# Altium project lightSoakV1.PrjPcb (part 2 of 2)

## Sheet V1_input_channel_noNegSply_sch.SchDoc
size A3; SheetNumber: 2; SheetTotal: 5
Used 6 times, as channels U_V1_input_channel_noNegSply_sch, U_V1_input_channel_noNegSply_sch, U_V1_input_channel_noNegSply_sch, U_V1_input_channel_noNegSply_sch, U_V1_input_channel_noNegSply_sch, U_V1_input_channel_noNegSply_sch. Parts and nets are listed once, with the designators drawn on the sheet.
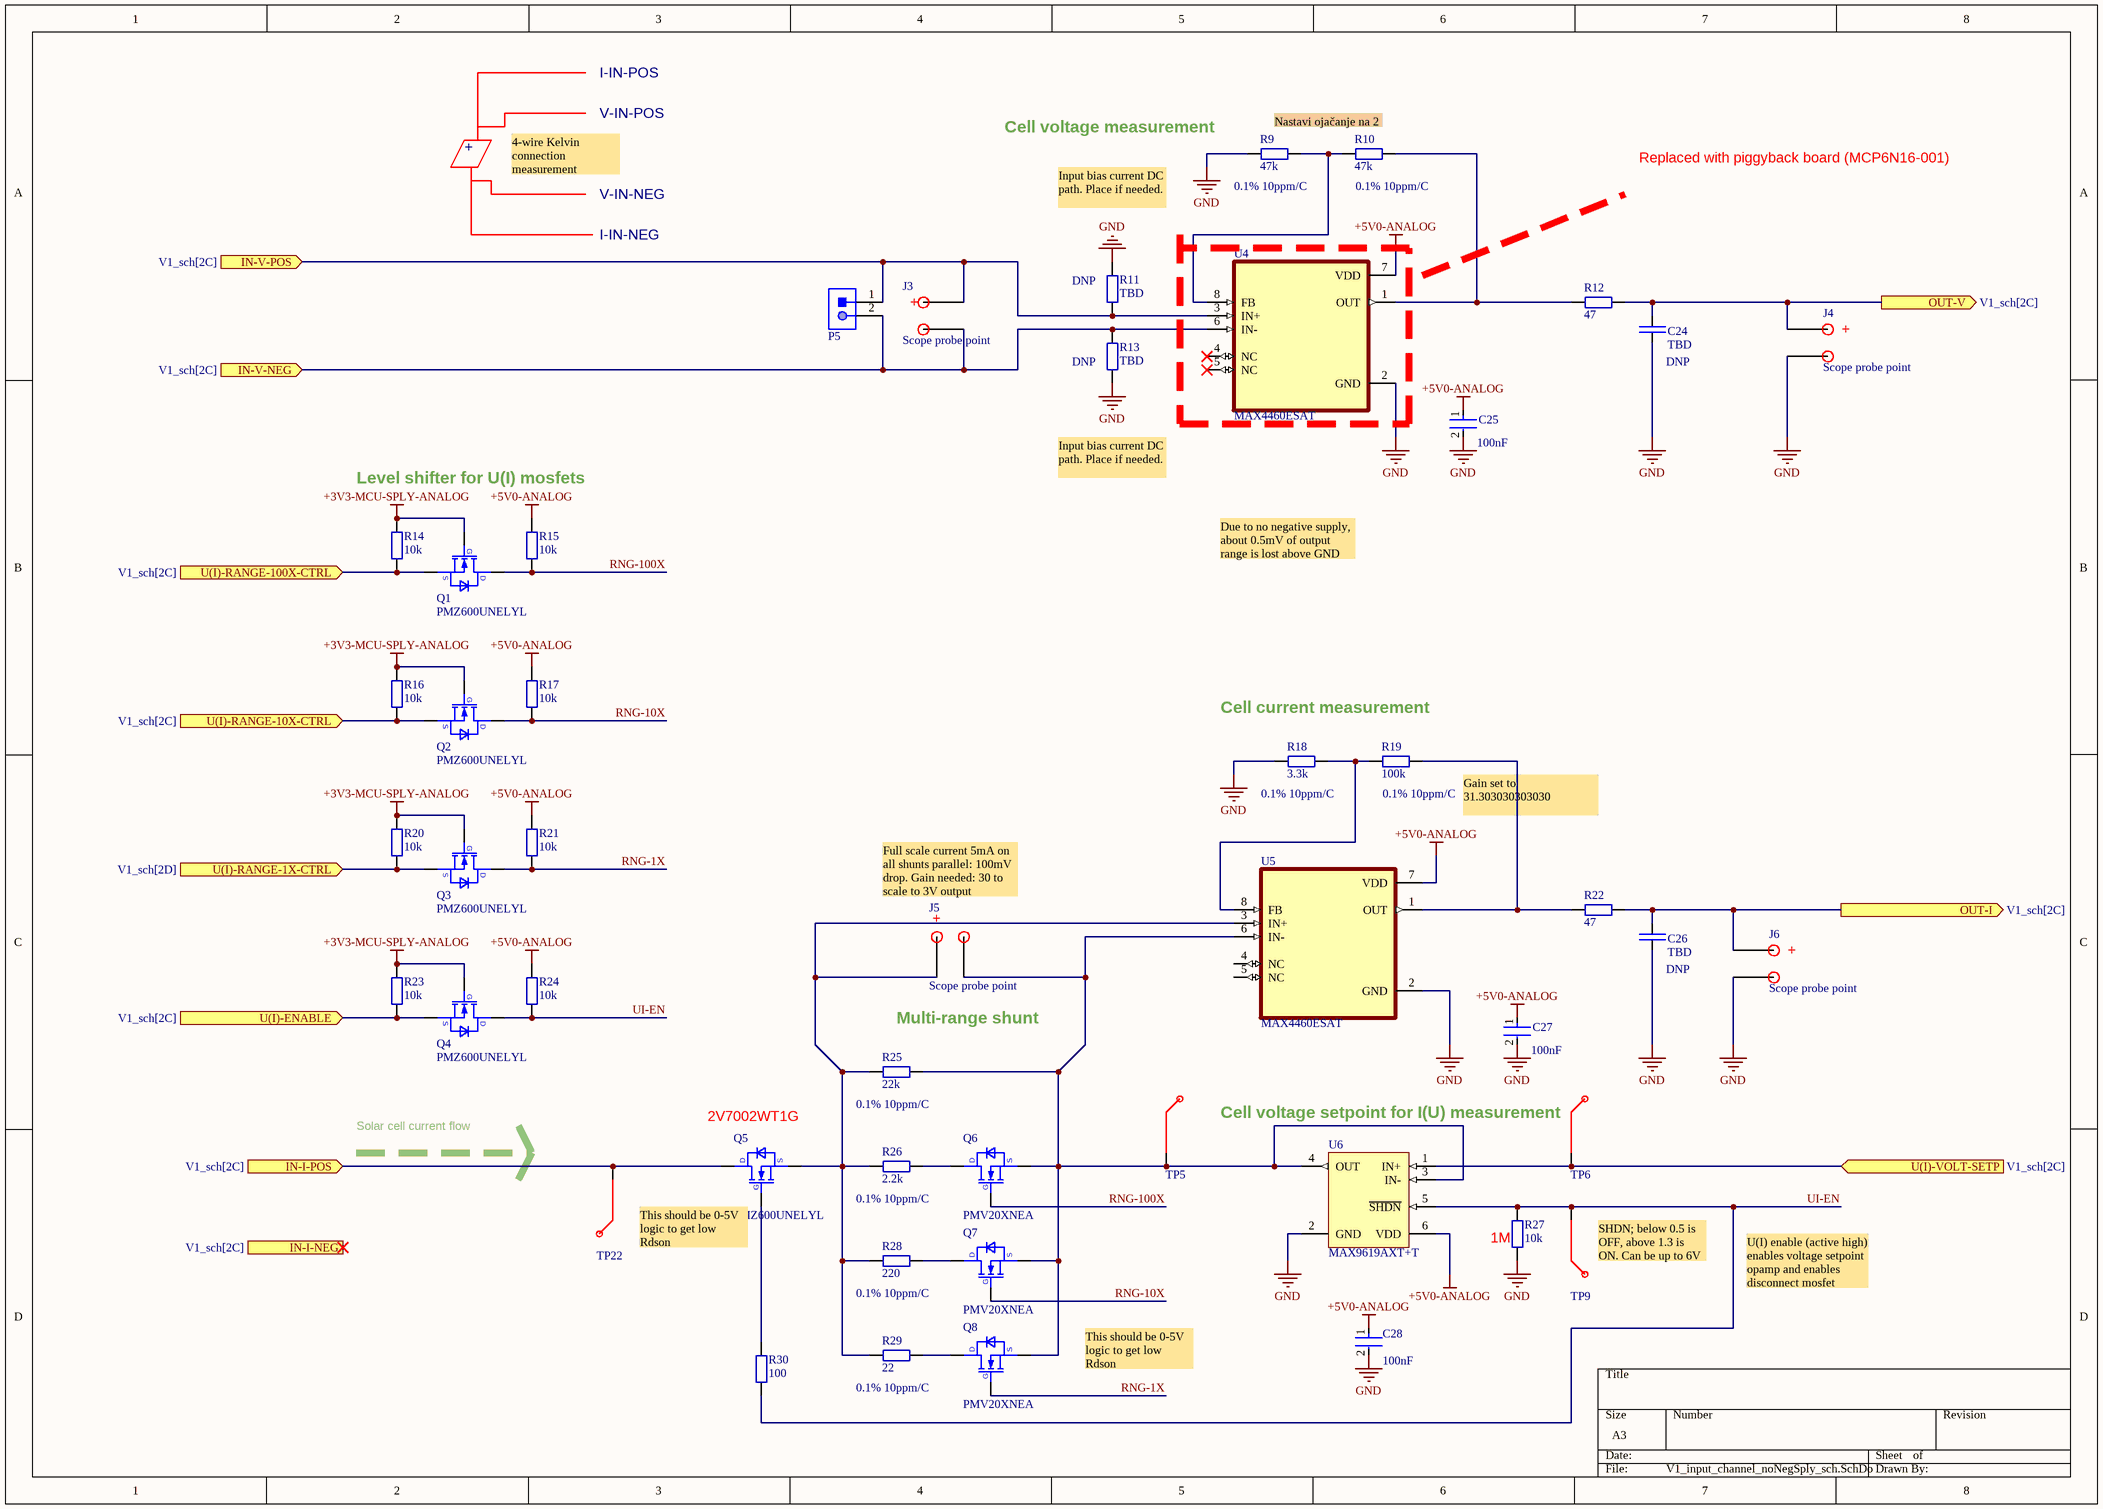
[diagram p6: V1_input_channel_noNegSply_sch.SchDoc]

### Parts
C24  value TBD  [FPR_0603_C_R0]  (hidden comment: PN_C0603_TBD)
C25  Capacitance: 100nF  [FP-885012206095-IPC_B]  (hidden comment: 885012206095)
C26  value TBD  [FPR_0603_C_R0]  (hidden comment: PN_C0603_TBD)
C27  Capacitance: 100nF  [FP-885012206095-IPC_B]  (hidden comment: 885012206095)
C28  Capacitance: 100nF  [FP-885012206095-IPC_B]  (hidden comment: 885012206095)
J3  Scope probe point  [scope with ground spring probe point]
J4  Scope probe point  [scope with ground spring probe point]
J5  Scope probe point  [scope with ground spring probe point]
J6  Scope probe point  [scope with ground spring probe point]
P5  61300211121  [61300211121]  (value not drawn)
Q1  PMZ600UNELYL  [DFN985X585X50-3N + SC-70 backup]
Q2  PMZ600UNELYL  [DFN985X585X50-3N + SC-70 backup]
Q3  PMZ600UNELYL  [DFN985X585X50-3N + SC-70 backup]
Q4  PMZ600UNELYL  [DFN985X585X50-3N + SC-70 backup]
Q5  PMZ600UNELYL  [DFN985X585X50-3N + SC-70 backup]
Q6  PMV20XNEA  [SOT-23 for nexperia mosfets]
Q7  PMV20XNEA  [SOT-23 for nexperia mosfets]
Q8  PMV20XNEA  [SOT-23 for nexperia mosfets]
R9  value 47k  Tolerance: 0.1% 10ppm/C  [FPR_0603_R_R0]  (hidden comment: PN_R0603_47k_0%1_10ppm)
R10  value 47k  Tolerance: 0.1% 10ppm/C  [FPR_0603_R_R0]  (hidden comment: PN_R0603_47k_0%1_10ppm)
R11  value TBD  [FPR_0805_R_R0]  (hidden comment: PN_R0603_TBD)
R12  value 47  [FPR_0603_R_R0]  (hidden comment: PN_R0603_TBD)
R13  value TBD  [FPR_0805_R_R0]  (hidden comment: PN_R0603_TBD)
R14  value 10k  [FPR_0603_R_R0]  (hidden comment: PN_R0603_10k)
R15  value 10k  [FPR_0603_R_R0]  (hidden comment: PN_R0603_10k)
R16  value 10k  [FPR_0603_R_R0]  (hidden comment: PN_R0603_10k)
R17  value 10k  [FPR_0603_R_R0]  (hidden comment: PN_R0603_10k)
R18  value 3.3k  Tolerance: 0.1% 10ppm/C  [FPR_0603_R_R0]  (hidden comment: PN_R0603_3k3_0%1_10ppm)
R19  value 100k  Tolerance: 0.1% 10ppm/C  [FPR_0603_R_R0]  (hidden comment: PN_R0603_100k_0%1_10ppm)
R20  value 10k  [FPR_0603_R_R0]  (hidden comment: PN_R0603_10k)
R21  value 10k  [FPR_0603_R_R0]  (hidden comment: PN_R0603_10k)
R22  value 47  [FPR_0603_R_R0]  (hidden comment: PN_R0603_TBD)
R23  value 10k  [FPR_0603_R_R0]  (hidden comment: PN_R0603_10k)
R24  value 10k  [FPR_0603_R_R0]  (hidden comment: PN_R0603_10k)
R25  value 22k  Tolerance: 0.1% 10ppm/C  [FPR_0603_R_R0]  (hidden comment: PN_R0603_22K_0%1_10ppm)
R26  value 2.2k  Tolerance: 0.1% 10ppm/C  [FPR_0603_R_R0]  (hidden comment: PN_R0603_2K2_0%1_10ppm)
R27  value 10k  [FPR_0603_R_R0]  (hidden comment: PN_R0603_10k)
R28  value 220  Tolerance: 0.1% 10ppm/C  [FPR_0603_R_R0]  (hidden comment: PN_R0603_220R_0%1_10ppm)
R29  value 22  Tolerance: 0.1% 10ppm/C  [FPR_0603_R_R0]  (hidden comment: PN_R0603_22R_0%1_10ppm)
R30  value 100  [FPR_0603_R_R0]  (hidden comment: PN_R0603_100R)
TP5  Test Point  [Test Point 1.5mm SMD]  (value not drawn)
TP6  Test Point  [Test Point 1.5mm SMD]  (value not drawn)
TP9  Test Point  [Test Point 1.5mm SMD]  (value not drawn)
TP22  Test Point  [Test Point 1.5mm SMD]  (value not drawn)
U4  MAX4460ESAT  [SOIC127P600X175-8N]
U5  MAX4460ESAT  [SOIC127P600X175-8N]
U6  MAX9619AXT+T  [X6SN+1_N]

### Ports
IN-I-NEG (in, see V1_sch[2C]), IN-I-POS (in, see V1_sch[2C]), IN-V-NEG (in, see V1_sch[2C]), IN-V-POS (in, see V1_sch[2C]), OUT-I (out, see V1_sch[2C]), OUT-V (out, see V1_sch[2C]), U(I)-ENABLE (in, see V1_sch[2C]), U(I)-RANGE-1X-CTRL (in, see V1_sch[2D]), U(I)-RANGE-10X-CTRL (in, see V1_sch[2C]), U(I)-RANGE-100X-CTRL (in, see V1_sch[2C]), U(I)-VOLT-SETP (in, see V1_sch[2C])

### Nets
+3V3-MCU-SPLY-ANALOG: Q1.1(GATE) Q2.1(GATE) Q3.1(GATE) Q4.1(GATE) R14.2 R16.2 R20.2 R23.2
+5V0-ANALOG: C25.1 C27.1 C28.1 R15.2 R17.2 R21.2 R24.2 U4.7(VDD) U5.7(VDD) U6.6(VDD)
GND: C24.1 C25.2 C26.1 C27.2 C28.2 J4.NEG J6.NEG R9.2 R11.2 R13.1 R18.2 R27.1 U4.2(GND) U5.2(GND) U6.2(GND)
IN-I-POS: Q5.3(DRAIN) TP22.1 ; port IN-I-POS
IN-V-NEG: J3.NEG P5.2 R13.2 U4.6(IN-) ; port IN-V-NEG
IN-V-POS: J3.POS P5.1 R11.1 U4.3(IN+) ; port IN-V-POS
OUT-I: C26.2 J6.POS R22.1 ; port OUT-I
OUT-V: C24.2 J4.POS R12.1 ; port OUT-V
RNG-1X: Q3.3(DRAIN) Q8.1(GATE) R21.1
RNG-10X: Q2.3(DRAIN) Q7.1(GATE) R17.1
RNG-100X: Q1.3(DRAIN) Q6.1(GATE) R15.1
U(I)-ENABLE: Q4.2(SOURCE) R23.1 ; port U(I)-ENABLE
U(I)-RANGE-1X-CTRL: Q3.2(SOURCE) R20.1 ; port U(I)-RANGE-1X-CTRL
U(I)-RANGE-10X-CTRL: Q2.2(SOURCE) R16.1 ; port U(I)-RANGE-10X-CTRL
U(I)-RANGE-100X-CTRL: Q1.2(SOURCE) R14.1 ; port U(I)-RANGE-100X-CTRL
U(I)-VOLT-SETP: TP6.1 U6.1(IN+) ; port U(I)-VOLT-SETP
UI-EN: Q4.3(DRAIN) R24.1 R27.2 R30.1 TP9.1 U6.5(~{SHDN})
NetJ5_NEG: J5.NEG Q6.2(SOURCE) Q7.2(SOURCE) Q8.2(SOURCE) R25.1 TP5.1 U5.6(IN-) U6.3(IN-) U6.4(OUT)
NetJ5_POS: J5.POS Q5.2(SOURCE) R25.2 R26.2 R28.2 R29.2 U5.3(IN+)
NetQ5_1: Q5.1(GATE) R30.2
NetQ6_3: Q6.3(DRAIN) R26.1
NetQ7_3: Q7.3(DRAIN) R28.1
NetQ8_3: Q8.3(DRAIN) R29.1
NetR9_1: R9.1 R10.2 U4.8(FB)
NetR10_1: R10.1 R12.2 U4.1(OUT)
NetR18_1: R18.1 R19.2 U5.8(FB)
NetR19_1: R19.1 R22.2 U5.1(OUT)

Not connected (* = marked no-connect by the designer): U4 4(NC)* 5(NC)*; U5 4(NC) 5(NC)

### Channels
U_V1_input_channel_noNegSply_sch: designators end in _U_V1_input_channel_noNegSply_sch#1; ports IN-I-NEG=DUT-BB12 IN-I-POS=DUT-A2 IN-V-NEG=DUT-BB11 IN-V-POS=DUT-A1 OUT-I=CH1-CUR OUT-V=CH1-VOLT U(I)-ENABLE=CH1-CUR-EN U(I)-RANGE-1X-CTRL=CH1-SHNTRNG-1 U(I)-RANGE-10X-CTRL=CH1-SHNTRNG-10 U(I)-RANGE-100X-CTRL=CH1-SHNTRNG-100 U(I)-VOLT-SETP=CH1-SETPOINT
U_V1_input_channel_noNegSply_sch: designators end in _U_V1_input_channel_noNegSply_sch#2; ports IN-I-NEG=DUT-BB12 IN-I-POS=DUT-B2 IN-V-NEG=DUT-BB21 IN-V-POS=DUT-B1 OUT-I=CH2-CUR OUT-V=CH2-VOLT U(I)-ENABLE=CH2-CUR-EN U(I)-RANGE-1X-CTRL=CH2-SHNTRNG-1 U(I)-RANGE-10X-CTRL=CH2-SHNTRNG-10 U(I)-RANGE-100X-CTRL=CH2-SHNTRNG-100 U(I)-VOLT-SETP=CH2-SETPOINT
U_V1_input_channel_noNegSply_sch: designators end in _U_V1_input_channel_noNegSply_sch#3; ports IN-I-NEG=DUT-BB12 IN-I-POS=DUT-C2 IN-V-NEG=DUT-BB11 IN-V-POS=DUT-C1 OUT-I=CH3-CUR OUT-V=CH3-VOLT U(I)-ENABLE=CH3-CUR-EN U(I)-RANGE-1X-CTRL=CH3-SHNTRNG-1 U(I)-RANGE-10X-CTRL=CH3-SHNTRNG-10 U(I)-RANGE-100X-CTRL=CH3-SHNTRNG-100 U(I)-VOLT-SETP=CH3-SETPOINT
U_V1_input_channel_noNegSply_sch: designators end in _U_V1_input_channel_noNegSply_sch#4; ports IN-I-NEG=DUT-BB12 IN-I-POS=DUT-D2 IN-V-NEG=DUT-BB21 IN-V-POS=DUT-D1 OUT-I=CH4-CUR OUT-V=CH4-VOLT U(I)-ENABLE=CH4-CUR-EN U(I)-RANGE-1X-CTRL=CH4-SHNTRNG-1 U(I)-RANGE-10X-CTRL=CH4-SHNTRNG-10 U(I)-RANGE-100X-CTRL=CH4-SHNTRNG-100 U(I)-VOLT-SETP=CH4-SETPOINT
U_V1_input_channel_noNegSply_sch: designators end in _U_V1_input_channel_noNegSply_sch#5; ports IN-I-NEG=DUT-BB12 IN-I-POS=DUT-E2 IN-V-NEG=DUT-BB11 IN-V-POS=DUT-E1 OUT-I=CH5-CUR OUT-V=CH5-VOLT U(I)-ENABLE=CH5-CUR-EN U(I)-RANGE-1X-CTRL=CH5-SHNTRNG-1 U(I)-RANGE-10X-CTRL=CH5-SHNTRNG-10 U(I)-RANGE-100X-CTRL=CH5-SHNTRNG-100 U(I)-VOLT-SETP=CH5-SETPOINT
U_V1_input_channel_noNegSply_sch: designators end in _U_V1_input_channel_noNegSply_sch#6; ports IN-I-NEG=DUT-BB12 IN-I-POS=DUT-F2 IN-V-NEG=DUT-BB21 IN-V-POS=DUT-F1 OUT-I=CH6-CUR OUT-V=CH6-VOLT U(I)-ENABLE=CH6-CUR-EN U(I)-RANGE-1X-CTRL=CH6-SHNTRNG-1 U(I)-RANGE-10X-CTRL=CH6-SHNTRNG-10 U(I)-RANGE-100X-CTRL=CH6-SHNTRNG-100 U(I)-VOLT-SETP=CH6-SETPOINT

### Notes on the sheet
- I-IN-POS
- V-IN-POS
- +
- 4-wire Kelvin connection measurement
- Cell voltage measurement
- Nastavi ojačanje na 2
- Replaced with piggyback board (MCP6N16-001)
- I-IN-NEG
- V-IN-NEG
- Input bias current DC path. Place if needed.
- Level shifter for U(I) mosfets
- Due to no negative supply, about 0.5mV of output range is lost above GND
- Cell current measurement
- Gain set to 31.303030303030
- (near J5) Full scale current 5mA on all shunts parallel: 100mV drop. Gain needed: 30 to scale to 3V output
- (near R25) Multi-range shunt
- Solar cell current flow
- (near Q5) 2V7002WT1G
- (near TP6) Cell voltage setpoint for I(U) measurement
- (near Q5) This should be 0-5V logic to get low Rdson
- (near R27) 1M
- (near TP9) SHDN; below 0.5 is OFF, above 1.3 is ON. Can be up to 6V
- U(I) enable (active high) enables voltage setpoint opamp and enables disconnect mosfet
- This should be 0-5V logic to get low Rdson
- (in symbol PMV20XNEA) D; S; G
- (in symbol PMZ600UNELYL) D; S; G
- (in symbol Scope probe point) +

### Library data of the parts
C24 C26 = C: Capacitor - generic SMD; DNP: DNP
C25 C27 C28 = CMP-207839-000004-1: CAP CER 0.1UF 50V X7R 0603; Tolerance: 10%; RoHS Compliant: Yes; Thickness: 0.037inch; Voltage Rating: 50V; Packaging: Cut Tape; Dielectric: X7R; Series: WCAP-CSGP; Width: 0.031inch; Max Operating Temperature: 125°C; Min Operating Temperature: -55°C; Case/Package: 0603; Case Code (Metric): 1608; Case Code (Imperial): 0603; Length: 0.063inch; Mount: Surface Mount; Voltage Rating (DC): 50V
P5 = CMP-1712-00002-4: THT Vertical Pin Header WR-PHD, Pitch 2.54 mm, Single Row, 2 pins; Manufacturer: Wurth Elektronik; Rated Current: 3A; Gender: Male; Withstanding Voltage: 500VAC; Working Voltage: 250VAC; Pitch: 2.54mm; Contact Resistance: 20mOhm; Pin Number: 2; Mounting Technology: THT; Orientation: Vertical; Operating Temperature: -40to105degC; Packaging: Bag; Publisher: WurthElektronik; Datasheet URL: https://katalog.we-online.de/em/datasheet/6130xx11121.pdf; Manufacturer URL: http://www.we-online.de; Row Number: Single; Package Reference: 61300211121; Part Number: 61300211121
Q1-Q5 = PMZ600UNELYL: Low leakage N mosfet
Q6-Q8 = PMV20XNEA: sot-23 N mosfet low Rdson
R9-R30 = R: Resistor - generic SMD
  R11 R13: DNP: DNP
U6 = CMP-0252-00044-1: 1.5MHz, High-Efficiency Single Op Amp with Zero-Drift and Rail to Rail IO, 6-Pin SC70, -40°C to +125°C, Pb-Free, Tape and Reel; ComponentLink2Description: Datasheet; ComponentLink3URL: http://pdfserv.maxim-ic.com/package_dwgs/21-0077.PDF; Code_JEDEC: MO-203; ComponentLink1URL: http://www.maxim-ic.com; ComponentLink3Description: Package Specification; ComponentLink2URL: http://datasheets.maxim-ic.com/en/ds/MAX9617-MAX9620.pdf; PackageVersion: revH, 2010; ComponentLink1Description: Manufacturer URL; PackageReference: X6SN+1; PackageDescription: 6-Pin SL70 Package 2 x 1.3 mm Body ,0.65 mm Pitch, Pb-Free; DatasheetVersion: Rev 5, Jul-2011
U4 U5 = MAX4460ESAT: Package: None; Price: None; Value: *; MP: MAX4460ESAT; Availability: Unavailable

## Sheet V1_PWM-to-analog_sch.SchDoc
size A4; SheetNumber: 5; SheetTotal: 5
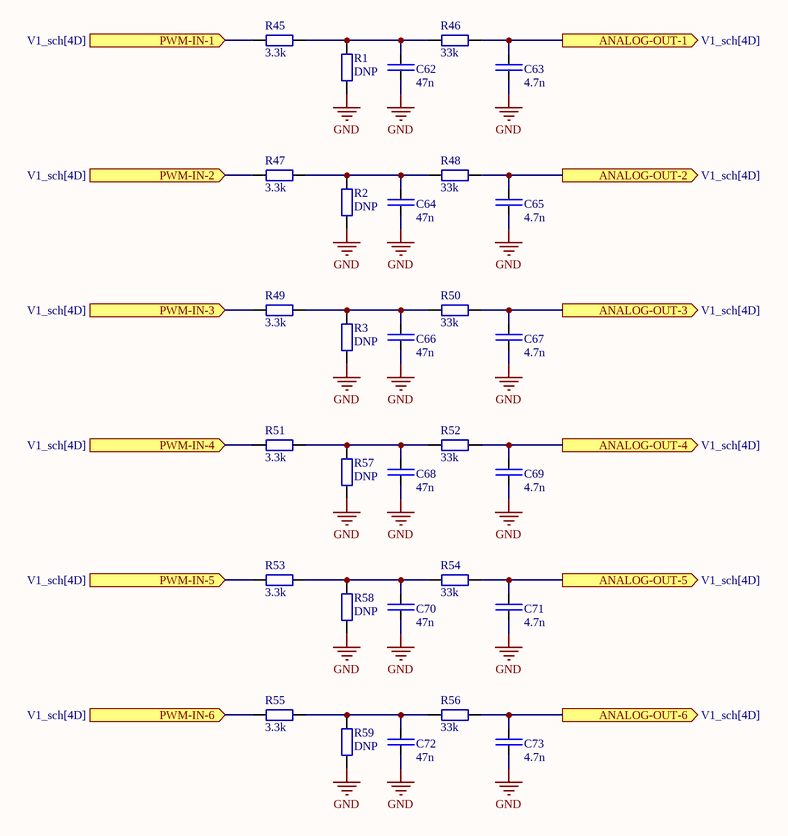
[diagram p7: V1_PWM-to-analog_sch.SchDoc]

### Parts
C62  value 47n  [FPR_0603_C_R0]  (hidden comment: PN_C0603_TBD)
C63  value 4.7n  [FPR_0603_C_R0]  (hidden comment: PN_C0603_TBD)
C64  value 47n  [FPR_0603_C_R0]  (hidden comment: PN_C0603_TBD)
C65  value 4.7n  [FPR_0603_C_R0]  (hidden comment: PN_C0603_TBD)
C66  value 47n  [FPR_0603_C_R0]  (hidden comment: PN_C0603_TBD)
C67  value 4.7n  [FPR_0603_C_R0]  (hidden comment: PN_C0603_TBD)
C68  value 47n  [FPR_0603_C_R0]  (hidden comment: PN_C0603_TBD)
C69  value 4.7n  [FPR_0603_C_R0]  (hidden comment: PN_C0603_TBD)
C70  value 47n  [FPR_0603_C_R0]  (hidden comment: PN_C0603_TBD)
C71  value 4.7n  [FPR_0603_C_R0]  (hidden comment: PN_C0603_TBD)
C72  value 47n  [FPR_0603_C_R0]  (hidden comment: PN_C0603_TBD)
C73  value 4.7n  [FPR_0603_C_R0]  (hidden comment: PN_C0603_TBD)
R1  value DNP  [FPR_0603_R_R0]  (hidden comment: PN_R0603_TBD)
R2  value DNP  [FPR_0603_R_R0]  (hidden comment: PN_R0603_TBD)
R3  value DNP  [FPR_0603_R_R0]  (hidden comment: PN_R0603_TBD)
R45  value 3.3k  [FPR_0603_R_R0]  (hidden comment: PN_R0603_TBD)
R46  value 33k  [FPR_0603_R_R0]  (hidden comment: PN_R0603_TBD)
R47  value 3.3k  [FPR_0603_R_R0]  (hidden comment: PN_R0603_TBD)
R48  value 33k  [FPR_0603_R_R0]  (hidden comment: PN_R0603_TBD)
R49  value 3.3k  [FPR_0603_R_R0]  (hidden comment: PN_R0603_TBD)
R50  value 33k  [FPR_0603_R_R0]  (hidden comment: PN_R0603_TBD)
R51  value 3.3k  [FPR_0603_R_R0]  (hidden comment: PN_R0603_TBD)
R52  value 33k  [FPR_0603_R_R0]  (hidden comment: PN_R0603_TBD)
R53  value 3.3k  [FPR_0603_R_R0]  (hidden comment: PN_R0603_TBD)
R54  value 33k  [FPR_0603_R_R0]  (hidden comment: PN_R0603_TBD)
R55  value 3.3k  [FPR_0603_R_R0]  (hidden comment: PN_R0603_TBD)
R56  value 33k  [FPR_0603_R_R0]  (hidden comment: PN_R0603_TBD)
R57  value DNP  [FPR_0603_R_R0]  (hidden comment: PN_R0603_TBD)
R58  value DNP  [FPR_0603_R_R0]  (hidden comment: PN_R0603_TBD)
R59  value DNP  [FPR_0603_R_R0]  (hidden comment: PN_R0603_TBD)

### Ports
ANALOG-OUT-1 (out, see V1_sch[4D]), ANALOG-OUT-2 (out, see V1_sch[4D]), ANALOG-OUT-3 (out, see V1_sch[4D]), ANALOG-OUT-4 (out, see V1_sch[4D]), ANALOG-OUT-5 (out, see V1_sch[4D]), ANALOG-OUT-6 (out, see V1_sch[4D]), PWM-IN-1 (in, see V1_sch[4D]), PWM-IN-2 (in, see V1_sch[4D]), PWM-IN-3 (in, see V1_sch[4D]), PWM-IN-4 (in, see V1_sch[4D]), PWM-IN-5 (in, see V1_sch[4D]), PWM-IN-6 (in, see V1_sch[4D])

### Nets
GND: C62.1 C63.1 C64.1 C65.1 C66.1 C67.1 C68.1 C69.1 C70.1 C71.1 C72.1 C73.1 R1.2 R2.2 R3.2 R57.2 R58.2 R59.2
CH1-SETPOINT: C63.2 R46.1 ; port ANALOG-OUT-1
CH2-SETPOINT: C65.2 R48.1 ; port ANALOG-OUT-2
CH3-SETPOINT: C67.2 R50.1 ; port ANALOG-OUT-3
CH4-SETPOINT: C69.2 R52.1 ; port ANALOG-OUT-4
CH5-SETPOINT: C71.2 R54.1 ; port ANALOG-OUT-5
CH6-SETPOINT: C73.2 R56.1 ; port ANALOG-OUT-6
PWM-SETP-1: R45.2 ; port PWM-IN-1
PWM-SETP-2: R47.2 ; port PWM-IN-2
PWM-SETP-3: R49.2 ; port PWM-IN-3
PWM-SETP-4: R51.2 ; port PWM-IN-4
PWM-SETP-5: R53.2 ; port PWM-IN-5
PWM-SETP-6: R55.2 ; port PWM-IN-6
NetC62_2: C62.2 R1.1 R45.1 R46.2
NetC64_2: C64.2 R2.1 R47.1 R48.2
NetC66_2: C66.2 R3.1 R49.1 R50.2
NetC68_2: C68.2 R51.1 R52.2 R57.1
NetC70_2: C70.2 R53.1 R54.2 R58.1
NetC72_2: C72.2 R55.1 R56.2 R59.1

### Library data of the parts
C62-C73 = C: Capacitor - generic SMD
R1-R3 R45-R59 = R: Resistor - generic SMD

## Nets that join several sheets
+3V3-MCU-SPLY: V1_sch (24 pins), V1_pwr_sply_noNegSply_sch (5 pins)
+3V3-MCU-SPLY-ANALOG: V1_sch (C17.2 FB1.2 U2.45), U_V1_input_channel_noNegSply_sch (8 pins), U_V1_input_channel_noNegSply_sch (8 pins), U_V1_input_channel_noNegSply_sch (8 pins), U_V1_input_channel_noNegSply_sch (8 pins), U_V1_input_channel_noNegSply_sch (8 pins), U_V1_input_channel_noNegSply_sch (8 pins)
+5V0-ANALOG: V1_sch (C13.1 U3.3 U3.4), V1_pwr_sply_noNegSply_sch (8 pins), U_V1_input_channel_noNegSply_sch (10 pins), U_V1_input_channel_noNegSply_sch (10 pins), U_V1_input_channel_noNegSply_sch (10 pins), U_V1_input_channel_noNegSply_sch (10 pins), U_V1_input_channel_noNegSply_sch (10 pins), U_V1_input_channel_noNegSply_sch (10 pins)
+12V-NOFILTER: V1_sch (J2.5 P4.1), V1_pwr_sply_noNegSply_sch (9 pins)
+24V0: V1_sch (M1.1), V1_pwr_sply_noNegSply_sch (7 pins)
+VBUS: V1_pwr_sply_noNegSply_sch (D3.2), V1_USB_sch (7 pins)
+VIN-NOFILTER: V1_sch (J2.1 J2.2), V1_pwr_sply_noNegSply_sch (5 pins)
DUT-BB12: V1_sch (J1.12 J1.14), V1_pwr_sply_noNegSply_sch (TP17.1 U11.1 U11.4)
GND: V1_sch (57 pins), V1_pwr_sply_noNegSply_sch (41 pins), V1_USB_sch (15 pins), U_V1_input_channel_noNegSply_sch (15 pins), U_V1_input_channel_noNegSply_sch (15 pins), U_V1_input_channel_noNegSply_sch (15 pins), U_V1_input_channel_noNegSply_sch (15 pins), U_V1_input_channel_noNegSply_sch (15 pins), U_V1_input_channel_noNegSply_sch (15 pins), V1_PWM-to-analog_sch (18 pins)
PWRGND: V1_sch (J2.3 J2.4), V1_pwr_sply_noNegSply_sch (5 pins)
CH1-CUR: V1_sch (C18.1 U2.53), U_V1_input_channel_noNegSply_sch (C26_U_V1_input_channel_noNegSply_sch#1.2 J6_U_V1_input_channel_noNegSply_sch#1.POS R22_U_V1_input_channel_noNegSply_sch#1.1)
CH1-CUR-EN: V1_sch (U2.18), U_V1_input_channel_noNegSply_sch (Q4_U_V1_input_channel_noNegSply_sch#1.2 R23_U_V1_input_channel_noNegSply_sch#1.1)
CH1-SETPOINT: U_V1_input_channel_noNegSply_sch (TP6_U_V1_input_channel_noNegSply_sch#1.1 U6_U_V1_input_channel_noNegSply_sch#1.1), V1_PWM-to-analog_sch (C63.2 R46.1)
CH1-SHNTRNG-1: V1_sch (U2.10), U_V1_input_channel_noNegSply_sch (Q3_U_V1_input_channel_noNegSply_sch#1.2 R20_U_V1_input_channel_noNegSply_sch#1.1)
CH1-SHNTRNG-10: V1_sch (U2.4), U_V1_input_channel_noNegSply_sch (Q2_U_V1_input_channel_noNegSply_sch#1.2 R16_U_V1_input_channel_noNegSply_sch#1.1)
CH1-SHNTRNG-100: V1_sch (U2.3), U_V1_input_channel_noNegSply_sch (Q1_U_V1_input_channel_noNegSply_sch#1.2 R14_U_V1_input_channel_noNegSply_sch#1.1)
CH1-VOLT: V1_sch (C19.1 U2.22), U_V1_input_channel_noNegSply_sch (C24_U_V1_input_channel_noNegSply_sch#1.2 J4_U_V1_input_channel_noNegSply_sch#1.POS R12_U_V1_input_channel_noNegSply_sch#1.1)
CH2-CUR: V1_sch (C23.1 U2.56), U_V1_input_channel_noNegSply_sch (C26_U_V1_input_channel_noNegSply_sch#2.2 J6_U_V1_input_channel_noNegSply_sch#2.POS R22_U_V1_input_channel_noNegSply_sch#2.1)
CH2-CUR-EN: V1_sch (U2.2), U_V1_input_channel_noNegSply_sch (Q4_U_V1_input_channel_noNegSply_sch#2.2 R23_U_V1_input_channel_noNegSply_sch#2.1)
CH2-SETPOINT: U_V1_input_channel_noNegSply_sch (TP6_U_V1_input_channel_noNegSply_sch#2.1 U6_U_V1_input_channel_noNegSply_sch#2.1), V1_PWM-to-analog_sch (C65.2 R48.1)
CH2-SHNTRNG-1: V1_sch (U2.117), U_V1_input_channel_noNegSply_sch (Q3_U_V1_input_channel_noNegSply_sch#2.2 R20_U_V1_input_channel_noNegSply_sch#2.1)
CH2-SHNTRNG-10: V1_sch (U2.114), U_V1_input_channel_noNegSply_sch (Q2_U_V1_input_channel_noNegSply_sch#2.2 R16_U_V1_input_channel_noNegSply_sch#2.1)
CH2-SHNTRNG-100: V1_sch (U2.112), U_V1_input_channel_noNegSply_sch (Q1_U_V1_input_channel_noNegSply_sch#2.2 R14_U_V1_input_channel_noNegSply_sch#2.1)
CH2-VOLT: V1_sch (C44.1 U2.25), U_V1_input_channel_noNegSply_sch (C24_U_V1_input_channel_noNegSply_sch#2.2 J4_U_V1_input_channel_noNegSply_sch#2.POS R12_U_V1_input_channel_noNegSply_sch#2.1)
CH3-CUR: V1_sch (C45.1 U2.54), U_V1_input_channel_noNegSply_sch (C26_U_V1_input_channel_noNegSply_sch#3.2 J6_U_V1_input_channel_noNegSply_sch#3.POS R22_U_V1_input_channel_noNegSply_sch#3.1)
CH3-CUR-EN: V1_sch (U2.17), U_V1_input_channel_noNegSply_sch (Q4_U_V1_input_channel_noNegSply_sch#3.2 R23_U_V1_input_channel_noNegSply_sch#3.1)
CH3-SETPOINT: U_V1_input_channel_noNegSply_sch (TP6_U_V1_input_channel_noNegSply_sch#3.1 U6_U_V1_input_channel_noNegSply_sch#3.1), V1_PWM-to-analog_sch (C67.2 R50.1)
CH3-SHNTRNG-1: V1_sch (U2.11), U_V1_input_channel_noNegSply_sch (Q3_U_V1_input_channel_noNegSply_sch#3.2 R20_U_V1_input_channel_noNegSply_sch#3.1)
CH3-SHNTRNG-10: V1_sch (U2.8), U_V1_input_channel_noNegSply_sch (Q2_U_V1_input_channel_noNegSply_sch#3.2 R16_U_V1_input_channel_noNegSply_sch#3.1)
CH3-SHNTRNG-100: V1_sch (U2.5), U_V1_input_channel_noNegSply_sch (Q1_U_V1_input_channel_noNegSply_sch#3.2 R14_U_V1_input_channel_noNegSply_sch#3.1)
CH3-VOLT: V1_sch (C46.1 U2.23), U_V1_input_channel_noNegSply_sch (C24_U_V1_input_channel_noNegSply_sch#3.2 J4_U_V1_input_channel_noNegSply_sch#3.POS R12_U_V1_input_channel_noNegSply_sch#3.1)
CH4-CUR: V1_sch (C47.1 U2.57), U_V1_input_channel_noNegSply_sch (C26_U_V1_input_channel_noNegSply_sch#4.2 J6_U_V1_input_channel_noNegSply_sch#4.POS R22_U_V1_input_channel_noNegSply_sch#4.1)
CH4-CUR-EN: V1_sch (U2.1), U_V1_input_channel_noNegSply_sch (Q4_U_V1_input_channel_noNegSply_sch#4.2 R23_U_V1_input_channel_noNegSply_sch#4.1)
CH4-SETPOINT: U_V1_input_channel_noNegSply_sch (TP6_U_V1_input_channel_noNegSply_sch#4.1 U6_U_V1_input_channel_noNegSply_sch#4.1), V1_PWM-to-analog_sch (C69.2 R52.1)
CH4-SHNTRNG-1: V1_sch (U2.121), U_V1_input_channel_noNegSply_sch (Q3_U_V1_input_channel_noNegSply_sch#4.2 R20_U_V1_input_channel_noNegSply_sch#4.1)
CH4-SHNTRNG-10: V1_sch (U2.116), U_V1_input_channel_noNegSply_sch (Q2_U_V1_input_channel_noNegSply_sch#4.2 R16_U_V1_input_channel_noNegSply_sch#4.1)
CH4-SHNTRNG-100: V1_sch (U2.113), U_V1_input_channel_noNegSply_sch (Q1_U_V1_input_channel_noNegSply_sch#4.2 R14_U_V1_input_channel_noNegSply_sch#4.1)
CH4-VOLT: V1_sch (C48.1 U2.27), U_V1_input_channel_noNegSply_sch (C24_U_V1_input_channel_noNegSply_sch#4.2 J4_U_V1_input_channel_noNegSply_sch#4.POS R12_U_V1_input_channel_noNegSply_sch#4.1)
CH5-CUR: V1_sch (C49.1 U2.55), U_V1_input_channel_noNegSply_sch (C26_U_V1_input_channel_noNegSply_sch#5.2 J6_U_V1_input_channel_noNegSply_sch#5.POS R22_U_V1_input_channel_noNegSply_sch#5.1)
CH5-CUR-EN: V1_sch (U2.16), U_V1_input_channel_noNegSply_sch (Q4_U_V1_input_channel_noNegSply_sch#5.2 R23_U_V1_input_channel_noNegSply_sch#5.1)
CH5-SETPOINT: U_V1_input_channel_noNegSply_sch (TP6_U_V1_input_channel_noNegSply_sch#5.1 U6_U_V1_input_channel_noNegSply_sch#5.1), V1_PWM-to-analog_sch (C71.2 R54.1)
CH5-SHNTRNG-1: V1_sch (U2.15), U_V1_input_channel_noNegSply_sch (Q3_U_V1_input_channel_noNegSply_sch#5.2 R20_U_V1_input_channel_noNegSply_sch#5.1)
CH5-SHNTRNG-10: V1_sch (U2.9), U_V1_input_channel_noNegSply_sch (Q2_U_V1_input_channel_noNegSply_sch#5.2 R16_U_V1_input_channel_noNegSply_sch#5.1)
CH5-SHNTRNG-100: V1_sch (U2.7), U_V1_input_channel_noNegSply_sch (Q1_U_V1_input_channel_noNegSply_sch#5.2 R14_U_V1_input_channel_noNegSply_sch#5.1)
CH5-VOLT: V1_sch (C74.1 U2.24), U_V1_input_channel_noNegSply_sch (C24_U_V1_input_channel_noNegSply_sch#5.2 J4_U_V1_input_channel_noNegSply_sch#5.POS R12_U_V1_input_channel_noNegSply_sch#5.1)
CH6-CUR: V1_sch (C75.1 U2.58), U_V1_input_channel_noNegSply_sch (C26_U_V1_input_channel_noNegSply_sch#6.2 J6_U_V1_input_channel_noNegSply_sch#6.POS R22_U_V1_input_channel_noNegSply_sch#6.1)
CH6-CUR-EN: V1_sch (U2.122), U_V1_input_channel_noNegSply_sch (Q4_U_V1_input_channel_noNegSply_sch#6.2 R23_U_V1_input_channel_noNegSply_sch#6.1)
CH6-SETPOINT: U_V1_input_channel_noNegSply_sch (TP6_U_V1_input_channel_noNegSply_sch#6.1 U6_U_V1_input_channel_noNegSply_sch#6.1), V1_PWM-to-analog_sch (C73.2 R56.1)
CH6-SHNTRNG-1: V1_sch (U2.120), U_V1_input_channel_noNegSply_sch (Q3_U_V1_input_channel_noNegSply_sch#6.2 R20_U_V1_input_channel_noNegSply_sch#6.1)
CH6-SHNTRNG-10: V1_sch (U2.119), U_V1_input_channel_noNegSply_sch (Q2_U_V1_input_channel_noNegSply_sch#6.2 R16_U_V1_input_channel_noNegSply_sch#6.1)
CH6-SHNTRNG-100: V1_sch (U2.115), U_V1_input_channel_noNegSply_sch (Q1_U_V1_input_channel_noNegSply_sch#6.2 R14_U_V1_input_channel_noNegSply_sch#6.1)
CH6-VOLT: V1_sch (C76.1 U2.28), U_V1_input_channel_noNegSply_sch (C24_U_V1_input_channel_noNegSply_sch#6.2 J4_U_V1_input_channel_noNegSply_sch#6.POS R12_U_V1_input_channel_noNegSply_sch#6.1)
DUT-A1: V1_sch (J1.19), U_V1_input_channel_noNegSply_sch (J3_U_V1_input_channel_noNegSply_sch#1.POS P5_U_V1_input_channel_noNegSply_sch#1.1 R11_U_V1_input_channel_noNegSply_sch#1.1 U4_U_V1_input_channel_noNegSply_sch#1.3)
DUT-A2: V1_sch (J1.20), U_V1_input_channel_noNegSply_sch (Q5_U_V1_input_channel_noNegSply_sch#1.3 TP22_U_V1_input_channel_noNegSply_sch#1.1)
DUT-B1: V1_sch (J1.5), U_V1_input_channel_noNegSply_sch (J3_U_V1_input_channel_noNegSply_sch#2.POS P5_U_V1_input_channel_noNegSply_sch#2.1 R11_U_V1_input_channel_noNegSply_sch#2.1 U4_U_V1_input_channel_noNegSply_sch#2.3)
DUT-B2: V1_sch (J1.6), U_V1_input_channel_noNegSply_sch (Q5_U_V1_input_channel_noNegSply_sch#2.3 TP22_U_V1_input_channel_noNegSply_sch#2.1)
DUT-BB11: V1_sch (J1.13), U_V1_input_channel_noNegSply_sch (J3_U_V1_input_channel_noNegSply_sch#1.NEG P5_U_V1_input_channel_noNegSply_sch#1.2 R13_U_V1_input_channel_noNegSply_sch#1.2 U4_U_V1_input_channel_noNegSply_sch#1.6), U_V1_input_channel_noNegSply_sch (J3_U_V1_input_channel_noNegSply_sch#3.NEG P5_U_V1_input_channel_noNegSply_sch#3.2 R13_U_V1_input_channel_noNegSply_sch#3.2 U4_U_V1_input_channel_noNegSply_sch#3.6), U_V1_input_channel_noNegSply_sch (J3_U_V1_input_channel_noNegSply_sch#5.NEG P5_U_V1_input_channel_noNegSply_sch#5.2 R13_U_V1_input_channel_noNegSply_sch#5.2 U4_U_V1_input_channel_noNegSply_sch#5.6)
DUT-BB21: V1_sch (J1.11), U_V1_input_channel_noNegSply_sch (J3_U_V1_input_channel_noNegSply_sch#2.NEG P5_U_V1_input_channel_noNegSply_sch#2.2 R13_U_V1_input_channel_noNegSply_sch#2.2 U4_U_V1_input_channel_noNegSply_sch#2.6), U_V1_input_channel_noNegSply_sch (J3_U_V1_input_channel_noNegSply_sch#4.NEG P5_U_V1_input_channel_noNegSply_sch#4.2 R13_U_V1_input_channel_noNegSply_sch#4.2 U4_U_V1_input_channel_noNegSply_sch#4.6), U_V1_input_channel_noNegSply_sch (J3_U_V1_input_channel_noNegSply_sch#6.NEG P5_U_V1_input_channel_noNegSply_sch#6.2 R13_U_V1_input_channel_noNegSply_sch#6.2 U4_U_V1_input_channel_noNegSply_sch#6.6)
DUT-C1: V1_sch (J1.17), U_V1_input_channel_noNegSply_sch (J3_U_V1_input_channel_noNegSply_sch#3.POS P5_U_V1_input_channel_noNegSply_sch#3.1 R11_U_V1_input_channel_noNegSply_sch#3.1 U4_U_V1_input_channel_noNegSply_sch#3.3)
DUT-C2: V1_sch (J1.18), U_V1_input_channel_noNegSply_sch (Q5_U_V1_input_channel_noNegSply_sch#3.3 TP22_U_V1_input_channel_noNegSply_sch#3.1)
DUT-D1: V1_sch (J1.7), U_V1_input_channel_noNegSply_sch (J3_U_V1_input_channel_noNegSply_sch#4.POS P5_U_V1_input_channel_noNegSply_sch#4.1 R11_U_V1_input_channel_noNegSply_sch#4.1 U4_U_V1_input_channel_noNegSply_sch#4.3)
DUT-D2: V1_sch (J1.8), U_V1_input_channel_noNegSply_sch (Q5_U_V1_input_channel_noNegSply_sch#4.3 TP22_U_V1_input_channel_noNegSply_sch#4.1)
DUT-E1: V1_sch (J1.15), U_V1_input_channel_noNegSply_sch (J3_U_V1_input_channel_noNegSply_sch#5.POS P5_U_V1_input_channel_noNegSply_sch#5.1 R11_U_V1_input_channel_noNegSply_sch#5.1 U4_U_V1_input_channel_noNegSply_sch#5.3)
DUT-E2: V1_sch (J1.16), U_V1_input_channel_noNegSply_sch (Q5_U_V1_input_channel_noNegSply_sch#5.3 TP22_U_V1_input_channel_noNegSply_sch#5.1)
DUT-F1: V1_sch (J1.9), U_V1_input_channel_noNegSply_sch (J3_U_V1_input_channel_noNegSply_sch#6.POS P5_U_V1_input_channel_noNegSply_sch#6.1 R11_U_V1_input_channel_noNegSply_sch#6.1 U4_U_V1_input_channel_noNegSply_sch#6.3)
DUT-F2: V1_sch (J1.10), U_V1_input_channel_noNegSply_sch (Q5_U_V1_input_channel_noNegSply_sch#6.3 TP22_U_V1_input_channel_noNegSply_sch#6.1)
MCU-COMMS-RX: V1_sch (U2.101), V1_USB_sch (TP20.1 U13.21)
MCU-COMMS-TX: V1_sch (U2.100), V1_USB_sch (TP21.1 U13.20)
PWM-SETP-1: V1_sch (U2.76), V1_PWM-to-analog_sch (R45.2)
PWM-SETP-2: V1_sch (U2.91), V1_PWM-to-analog_sch (R47.2)
PWM-SETP-3: V1_sch (U2.77), V1_PWM-to-analog_sch (R49.2)
PWM-SETP-4: V1_sch (U2.92), V1_PWM-to-analog_sch (R51.2)
PWM-SETP-5: V1_sch (U2.90), V1_PWM-to-analog_sch (R53.2)
PWM-SETP-6: V1_sch (U2.93), V1_PWM-to-analog_sch (R55.2)